# EAGLE schematic science arm board (EAGLE 6.5.0)
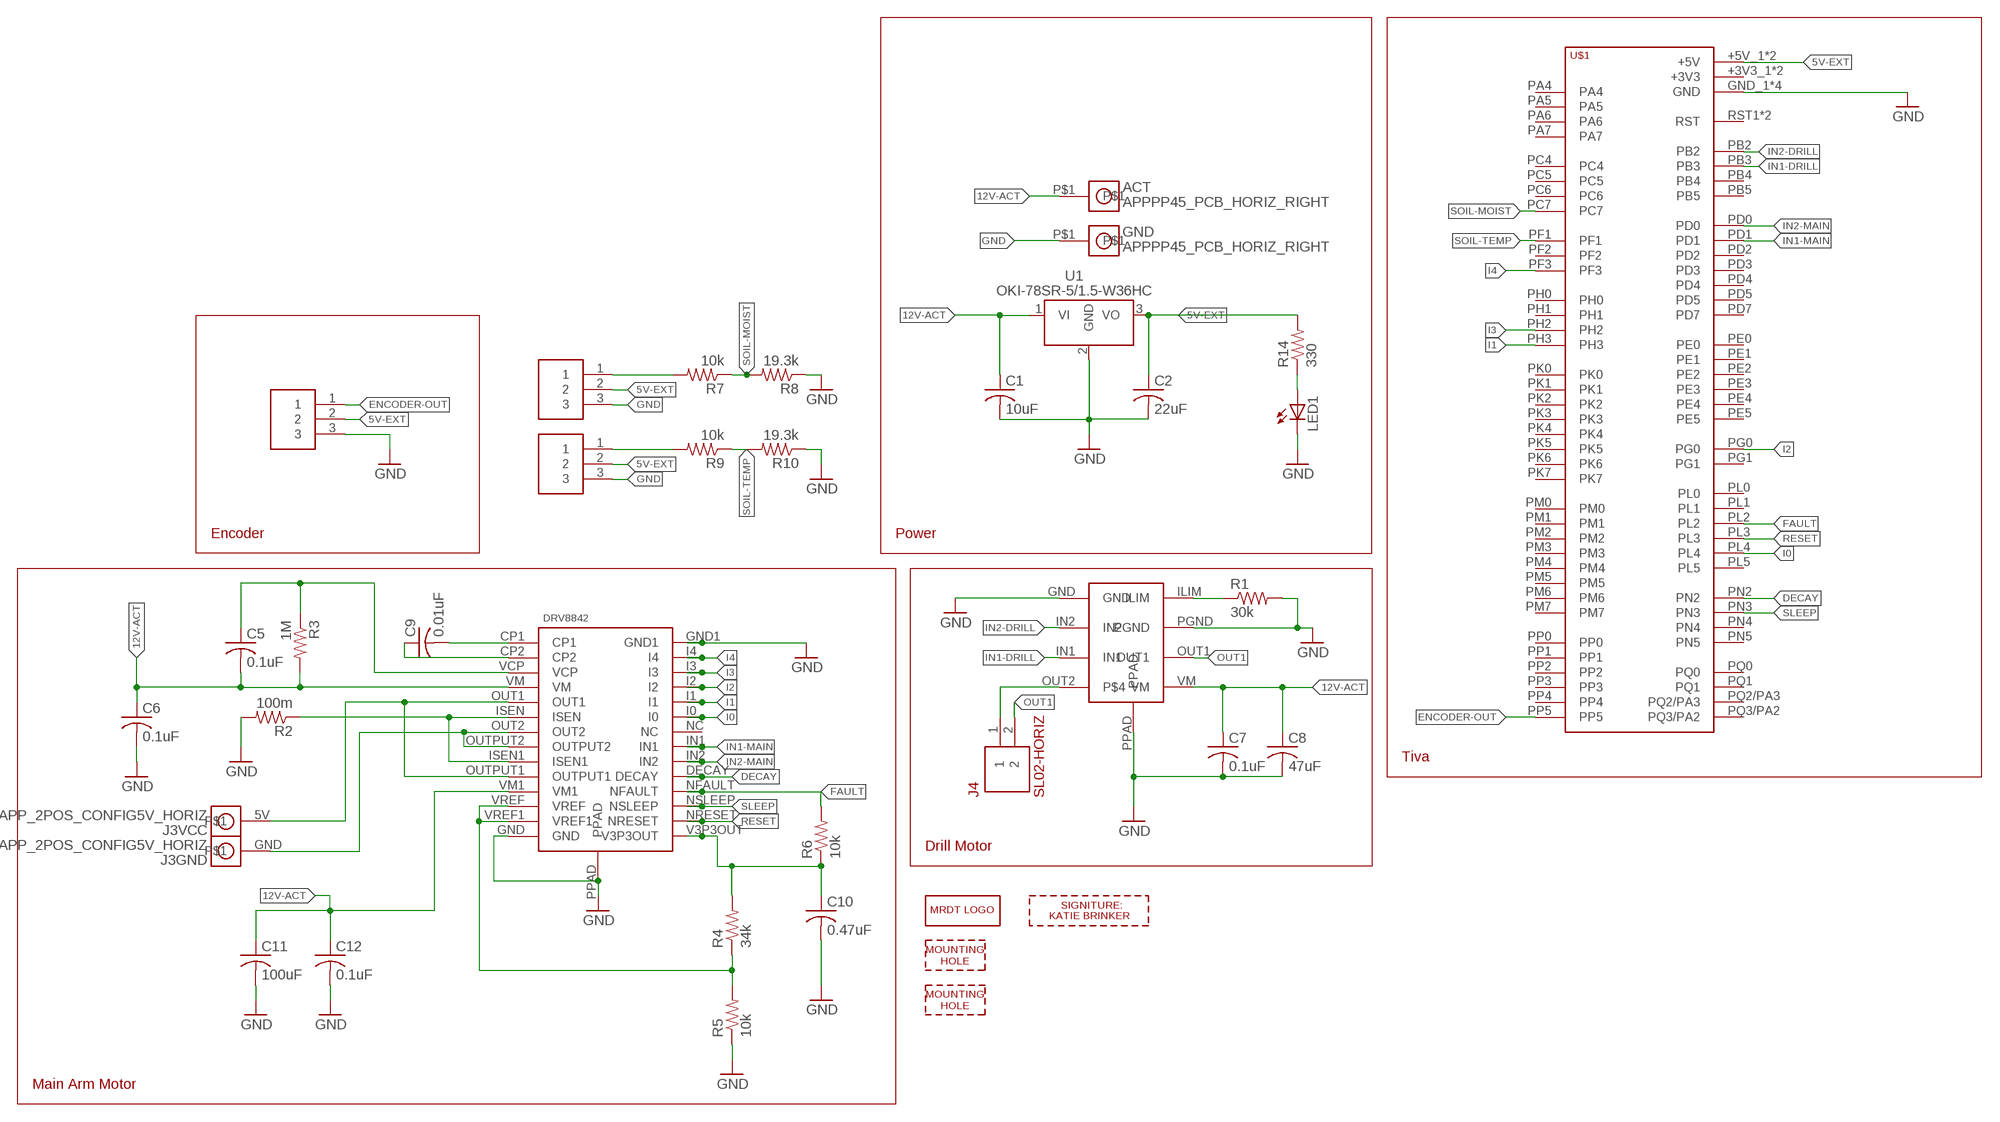
[diagram p0: schematic, sheet 1]

## Parts
ACT  APPPP45_PCB_HORIZ_RIGHT  [APP45_PCB_HORIZ_RIGHT]
C1  10uF  C-USC0805  [C0805]
C2  22uF  C-USC0805  [C0805]
C5  0.1uF  C-USC0805  [C0805]
C6  0.1uF  C-USC0805  [C0805]
C7  0.1uF  C-USC0805  [C0805]
C8  47uF  C-USC0805  [C0805]
C9  0.01uF  C-USC0805  [C0805]
C10  0.47uF  C-USC0805  [C0805]
C11  100uF  C-USC0805  [C0805]
C12  0.1uF  C-USC0805  [C0805]
GND  APPPP45_PCB_HORIZ_RIGHT  [APP45_PCB_HORIZ_RIGHT]
H1  MOUNTING_HOLE#6  [#6_SCREW]
H5  MOUNTING_HOLE#6  [#6_SCREW]
J1  SL03THROUGH_HOLE  [MOLEX_SL_03_TH]
J2  SL03THROUGH_HOLE  [MOLEX_SL_03_TH]
J3  APP_2POS_CONFIG5V_HORIZ  [APP45_5V_HORIZ_CONFIG]
J4  SL02-HORIZ  [MOLEX-70551-0001]
J6  SL03THROUGH_HOLE  [MOLEX_SL_03_TH]
LED1  LEDCHIP-LED0805  [CHIP-LED0805]
LOGO1  MRDT_LOGO  [MRDT_LOGO]
R1  30k  R-US_R0805  [R0805]
R2  100m  R-US_R0805  [R0805]
R3  1M  R-US_R0805  [R0805]
R4  34k  R-US_R0805  [R0805]
R5  10k  R-US_R0805  [R0805]
R6  10k  R-US_R0805  [R0805]
R7  10k  R-US_R0805  [R0805]
R8  19.3k  R-US_R0805  [R0805]
R9  10k  R-US_R0805  [R0805]
R10  19.3k  R-US_R0805  [R0805]
R14  330  R-US_M0805  [M0805]
U1  OKI-78SR-5/1.5-W36HC  [OKI-78SR_HORIZ]
U$1  TIVA-1294  [TIVA-C-CONNECTED]
U$2  DRV8842  [DRV8842]
U$3  DRV8871  [DRV8871]
U$5  KATIE-BRINKER  [KATIE-BRINKER-SIG]

## Nets
3V3: C10.1 R4.2 R6.1 U$2.V3P3OUT
5V-EXT: C2.1 J1.2 J2.2 J6.2 R14.2 U1.3(VO) U$1.+5V_1(+5V) U$1.+5V_2(+5V)
12V-ACT: ACT.P$1 C1.1 C5.2 C6.1 C7.1 C8.1 C11.1 C12.1 R3.2 U1.1(VI) U$2.VM U$2.VM1 U$3.VM
DECAY: U$1.PN2 U$2.DECAY
ENCODER-OUT: J6.1 U$1.PP5
FAULT: R6.2 U$1.PL2 U$2.NFAULT
GND: C1.2 C2.2 C6.2 C7.2 C8.2 C10.2 C11.2 C12.2 GND.P$1 J1.3 J2.3 J6.3 LED1.C R1.2 R2.2 R5.1 R8.1 R10.1 U1.2(GND) U$1.GND_1(GND) U$1.GND_2(GND) U$1.GND_3(GND) U$1.GND_4(GND) U$2.GND U$2.GND1 U$2.PPAD U$3.GND U$3.PGND U$3.PPAD
I0: U$1.PL4 U$2.I0
I1: U$1.PH3 U$2.I1
I2: U$1.PG0 U$2.I2
I3: U$1.PH2 U$2.I3
I4: U$1.PF3 U$2.I4
IN1-DRILL: U$1.PB3 U$3.IN1
IN1-MAIN: U$1.PD1 U$2.IN1
IN2-DRILL: U$1.PB2 U$3.IN2
IN2-MAIN: U$1.PD0 U$2.IN2
N$1: R1.1 U$3.ILIM
N$2: J4.1 U$3.OUT2
N$3: R2.1 U$2.ISEN U$2.ISEN1
N$6: C9.2 U$2.CP1
N$7: C9.1 U$2.CP2
N$8: C5.1 R3.1 U$2.VCP
N$9: R4.1 R5.2 U$2.VREF U$2.VREF1
N$35: J1.1 R7.2
N$36: J2.1 R9.2
N$37: LED1.A R14.1
OUT1: J4.2 U$3.OUT1
OUTPUT1: J3.5V U$2.OUT1 U$2.OUTPUT1
OUTPUT2: J3.GND U$2.OUT2 U$2.OUTPUT2
RESET: U$1.PL3 U$2.NRESET
SLEEP: U$1.PN3 U$2.NSLEEP
SOIL-MOIST: R7.1 R8.2 U$1.PC7
SOIL-TEMP: R9.1 R10.2 U$1.PF1
Unconnected: U$1.+3V3_1(+3V3) U$1.+3V3_2(+3V3) U$1.PA4 U$1.PA5 U$1.PA6 U$1.PA7 U$1.PB4 U$1.PB5 U$1.PC4 U$1.PC5 U$1.PC6 U$1.PD2 U$1.PD3 U$1.PD4 U$1.PD5 U$1.PD7 U$1.PE0 U$1.PE1 U$1.PE2 U$1.PE3 U$1.PE4 U$1.PE5 U$1.PF2 U$1.PG1 U$1.PH0 U$1.PH1 U$1.PK0 U$1.PK1 U$1.PK2 U$1.PK3 U$1.PK4 U$1.PK5 U$1.PK6 U$1.PK7 U$1.PL0 U$1.PL1 U$1.PL5 U$1.PM0 U$1.PM1 U$1.PM2 U$1.PM3 U$1.PM4 U$1.PM5 U$1.PM6 U$1.PM7 U$1.PN4 U$1.PN5 U$1.PP0 U$1.PP1 U$1.PP2 U$1.PP3 U$1.PP4 U$1.PQ0 U$1.PQ1 U$1.PQ2/PA3 U$1.PQ3/PA2 U$1.RST1(RST) U$1.RST_2(RST) U$2.NC

## Notes on the sheet
- Encoder | Power
- Tiva
- Drill Motor
- Main Arm Motor

## Library data of the parts
ACT GND = MRDT-Connectors:APP: http://www.powerwerx.com/anderson-powerpoles/
C1 C2 C5-C12 = rcl:C-US: CAPACITOR, American symbol
H1 H5 = MRDT-Hardware:MOUNTING_HOLE: Mounting hole for M6 bolt. Standard use mounting hole for: Tiva C Connected - M6 Anderson Powerpole Mounting Wing - M8 Most frame-mounted PCB's - M8
J1 J2 J6 = MRDT-Connectors:SL03: Molex 3-pin SL connector Locking 3 pin connector with standard header spacing. Backward compatible with standard RC servo connectors.; ORIENT: HORIZ; PARTNO: 0705550002
J3 = MRDT-Connectors:APP_2POS_CONFIG; COLOR1: RED; COLOR2: BLACK
J4 = MRDT-Connectors:SL02
LED1 = led:LED: LED OSRAM: - CHIPLED LG R971, LG N971, LY N971, LG Q971, LY Q971, LO R971, LY R971 LH N974, LH R974 LS Q976, LO Q976, LY Q976 LO Q996 - Hyper CHIPLED LW Q18S LB Q993, LB Q99A, LB R99A - SideLED LS A670, LO A670, LY A670, LG A670, LP A670 LB A673, LV A673, LT A673, LW A673 LH A674 LY A675 LS A676, LA A676, LO A676, LY A676, LW A676 LS A679, LY A679, LG A679 - Hyper Micro SIDELED® LS Y876, LA Y876, LO Y876, LY Y876 LT Y87S - SmartLED LW L88C, LW L88S LB L89C, LB L89S, LG L890 LS L89K, LO L89K, LY L89K LS L896, LA L896, LO L896, LY L896 - TOPLED LS T670, LO T670, LY T670, LG T670, LP T670 LSG T670, LSP T670, LSY T670, LOP T670, LYG T670 LG T671, LOG T671, LSG T671 LB T673, LV T673, LT T673, LW T673 LH T674 LS T676, LA T676, LO T676, LY T676, LB T676, LH T676, LSB T676, LW T676 LB T67C, LV T67C, LT T67C, LS T67K, LO T67K, LY T67K, LW E67C LS E67B, LA E67B, LO E67B, LY E67B, LB E67C, LV E67C, LT E67C LW T67C LS T679, LY T679, LG T679 LS T770, LO T770, LY T770, LG T770, LP T770 LB T773, LV T773, LT T773, LW T773 LH T774 LS E675, LA E675, LY E675, LS T675 LS T776, LA T776, LO T776, LY T776, LB T776 LHGB T686 LT T68C, LB T68C - Hyper Mini TOPLED® LB M676 - Mini TOPLED Santana® LG M470 LS M47K, LO M47K, LY M47K Source: http://www.osram.convergy.de LUXEON: - LUMILED® LXK2-PW12-R00, LXK2-PW12-S00, LXK2-PW14-U00, LXK2-PW14-V00 LXK2-PM12-R00, LXK2-PM12-S00, LXK2-PM14-U00 LXK2-PE12-Q00, LXK2-PE12-R00, LXK2-PE12-S00, LXK2-PE14-T00, LXK2-PE14-U00 LXK2-PB12-K00, LXK2-PB12-L00, LXK2-PB12-M00, LXK2-PB14-N00, LXK2-PB14-P00, LXK2-PB14-Q00 LXK2-PR12-L00, LXK2-PR12-M00, LXK2-PR14-Q00, LXK2-PR14-R00 LXK2-PD12-Q00, LXK2-PD12-R00, LXK2-PD12-S00 LXK2-PH12-R00, LXK2-PH12-S00 LXK2-PL12-P00, LXK2-PL12-Q00, LXK2-PL12-R00 Source: www.luxeon.com KINGBRIGHT: KA-3528ASYC Source: www.kingbright.com
LOGO1 = MRDT-Hardware:MRDT_LOGO
R1-R10 R14 = rcl:R-US_: RESISTOR, American symbol
U1 = MRDT-ICs:OKI-78SR-*/1.5-W36?C: 4.95W DC/DC Converter Manufacturer: Murata; VOUT: +5v
U$1 = MRDT-Microcontrollers:TIVA-1294: TIVA C CONNECTED LAUNCHPAD
U$2 = DRV8842:DRV8842
U$3 = drill-motor-driver:DRV8871
U$5 = sig:KATIE-BRINKER